# Altium schematic sheet RS232.SchDoc
size A
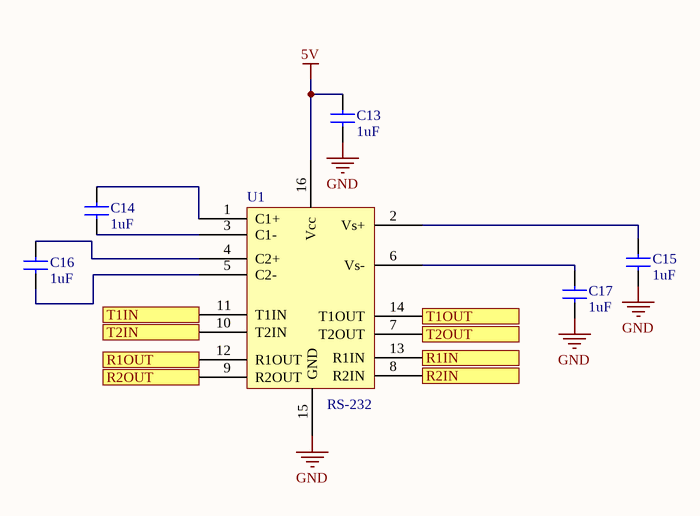
[diagram p0: RS232.SchDoc]

## Parts
C13  value 1uF  [CAPC0603]  (hidden comment: Cap)
C14  value 1uF  [CAPC0603]  (hidden comment: Cap)
C15  value 1uF  [CAPC0603]  (hidden comment: Cap)
C16  value 1uF  [CAPC0603]  (hidden comment: Cap)
C17  value 1uF  [CAPC0603]  (hidden comment: Cap)
U1  RS-232  [RS-232]

## Ports
R1IN, R1OUT, R2IN, R2OUT, T1IN, T1OUT, T2IN, T2OUT

## Nets
5V: C13.1(A) U1.16(Vcc)
GND: C13.2(B) C15.2(B) C17.2(B) U1.15(GND)
R1IN: U1.13(R1IN) ; port R1IN
R1OUT: U1.12(R1OUT) ; port R1OUT
R2IN: U1.8(R2IN) ; port R2IN
R2OUT: U1.9(R2OUT) ; port R2OUT
T1IN: U1.11(T1IN) ; port T1IN
T1OUT: U1.14(T1OUT) ; port T1OUT
T2IN: U1.10(T2IN) ; port T2IN
T2OUT: U1.7(T2OUT) ; port T2OUT
NetC14_1: C14.1(A) U1.1(C1+)
NetC14_2: C14.2(B) U1.3(C1-)
NetC15_1: C15.1(A) U1.2(Vs+)
NetC16_1: C16.1(A) U1.4(C2+)
NetC16_2: C16.2(B) U1.5(C2-)
NetC17_1: C17.1(A) U1.6(Vs-)

## Library data of the parts
U1 = RS-232: IC DVR/RCVR RS232 DUAL 16SOIC; Manufacturer 1: Texas Instruments; Supplier 1: Digi-Key; Supplier Part Number 1: 296-25009-1-ND; Manufacturer Part Number 1: RS-232; ComponentLink1URL: *http://www.ti.com/lit/ds/symlink/trs232.pdf; ComponentLink1URL: *; ComponentLinkURL: *; ComponentLink1URL: asdfsdaf; ComponentLink1Description: Datasheet; ComponentLink1URL: http://www.ti.com/lit/ds/symlink/trs232.pdf; ComponentLink2Description: Website; ComponentLink2URL: https://www.digikey.com/product-detail/en/texas-instruments/TRS232DR/296-25009-1-ND/2136546
C13-C17 = Cap: Supplier 1: Digi-Key; Supplier Part Number 1: 1276-1000-1-ND